# Altium schematic sheet HMI Features.SchDoc
size A3; Company Name: Renesas Electronics America; CompanyURL: www.renesas.com; PageSetup: Record=PageOptions|CenterHorizontal=True|CenterVertical=True|PrintScale=1.00|XCorrection=1.00|YCorrection=1.00|PrintKind=1|BorderSize=5000000|LeftOffset=0|BottomOffset=0|Orientation=2|PaperLength=1000|PaperWidth=1000|Scale=100|PaperSource=7|PrintQuality=-4|MediaType=1|DitherType=10|PaperKind=A5 148x210mm|PrintScaleMode=1; ReleaseDate: 16.09.2025; Version: MP; SheetNumber: 3; SheetTotal: 18; VariantNumber: 0; DSheetNumber: 1
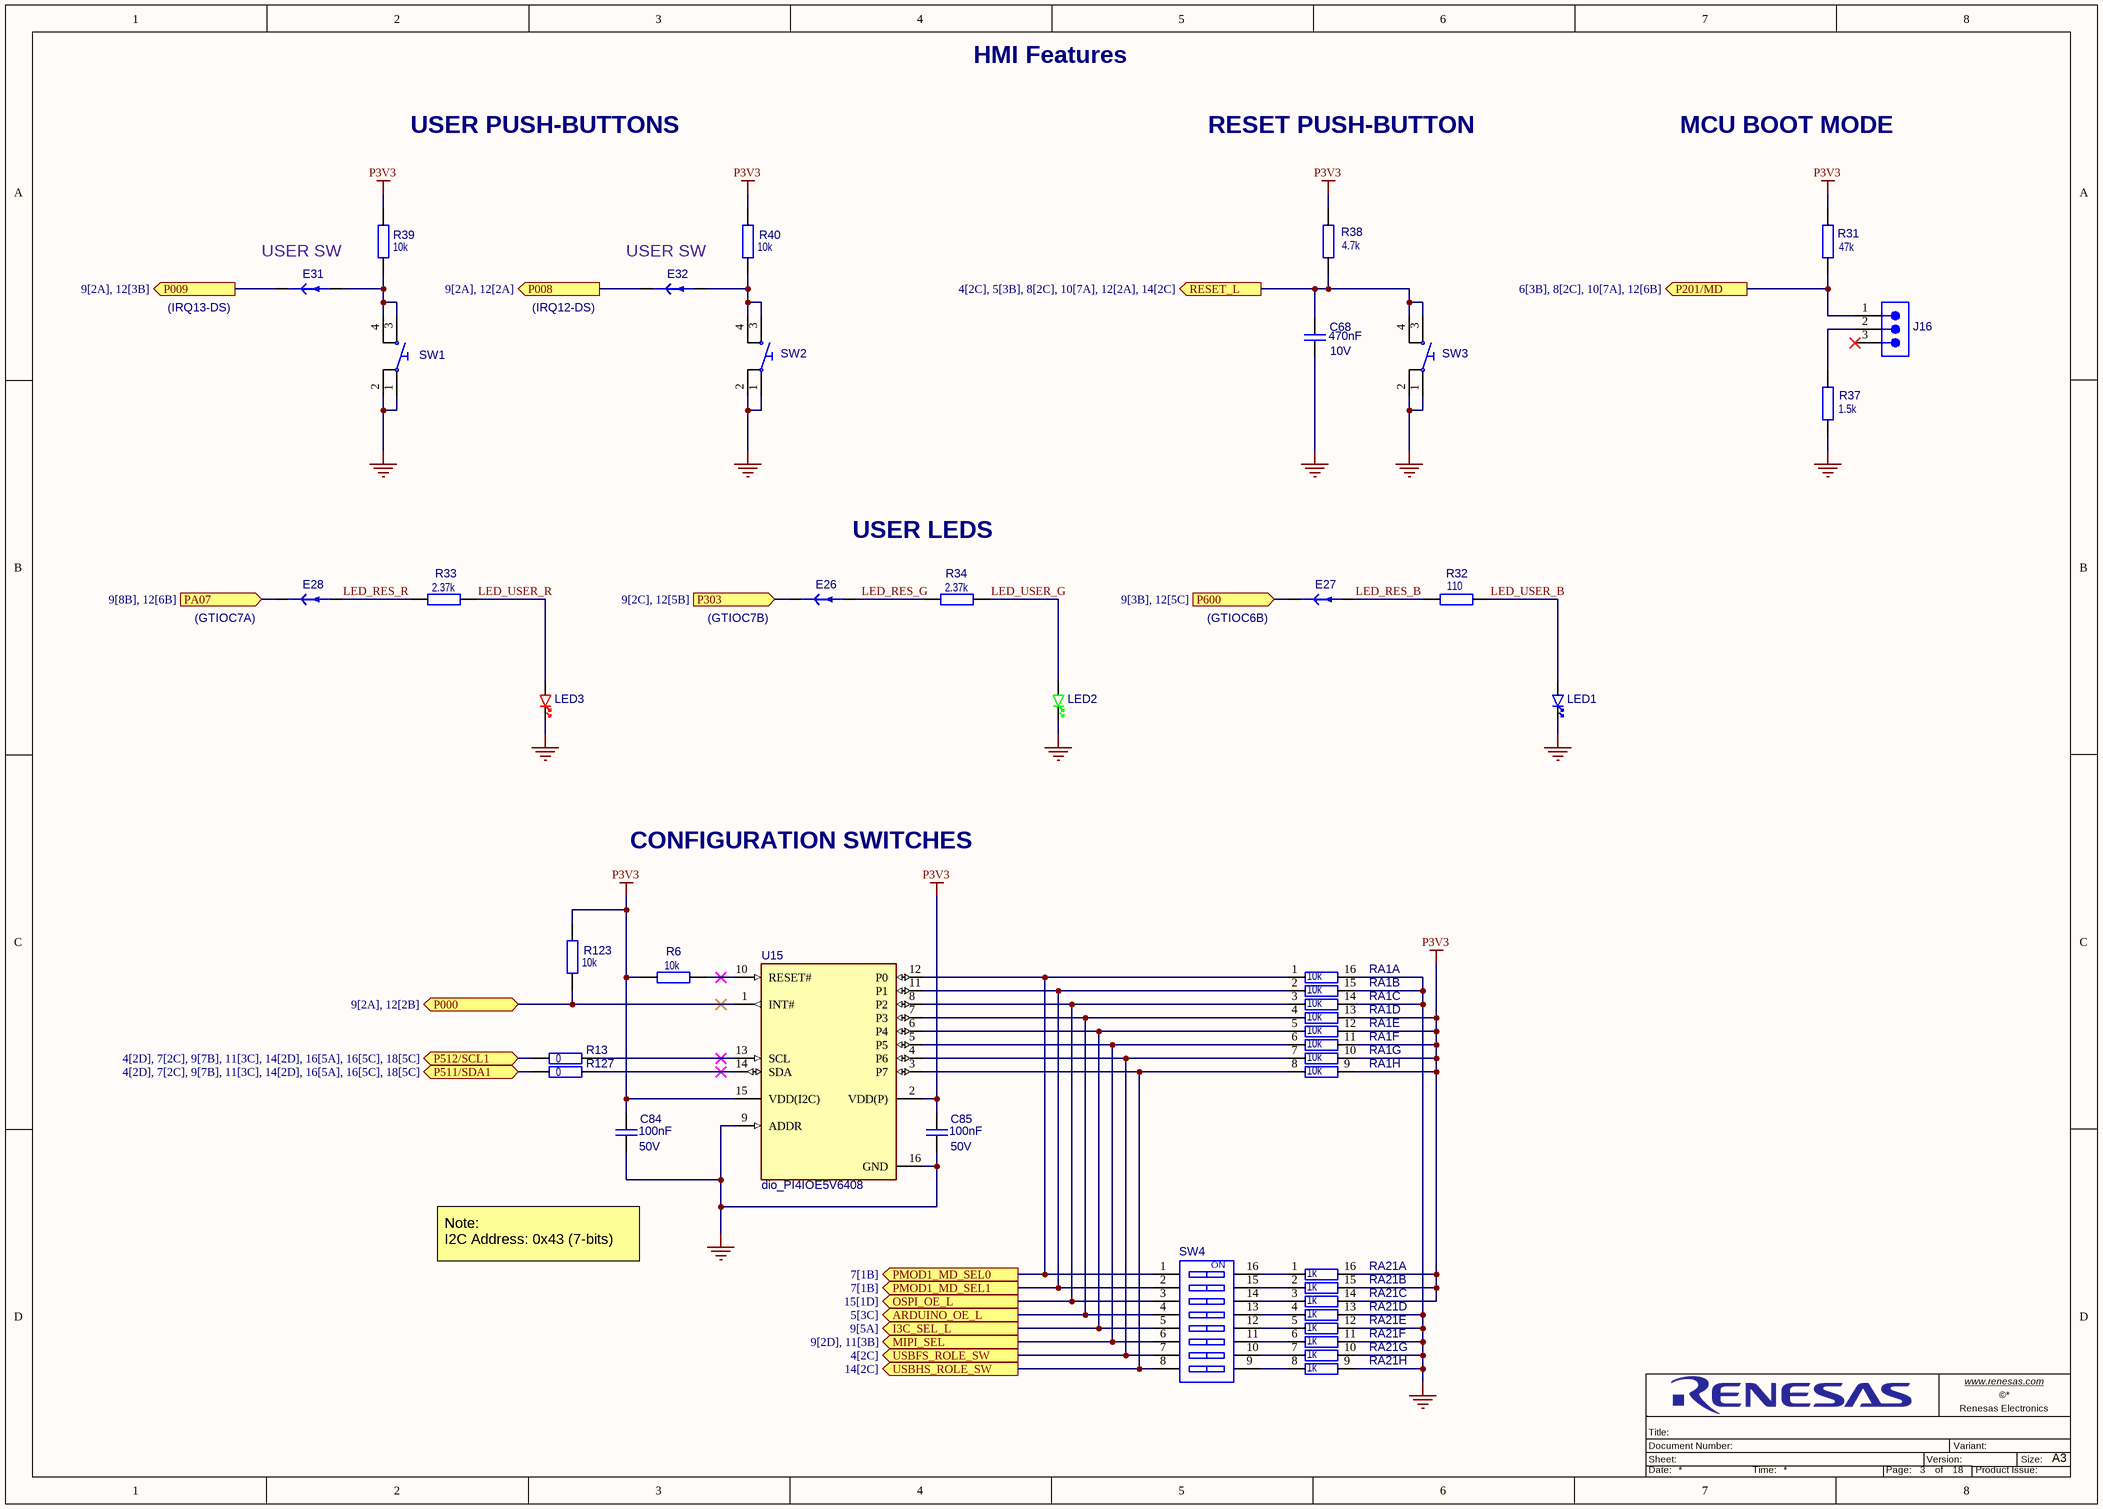
[diagram p0: HMI Features.SchDoc]

## Parts
C68  value 470nF  Operating Voltage Max: 10V  [C_EIA0402_0p55]  (hidden comment: Capacitor)
C84  value 100nF  Operating Voltage Max: 50V  [C_EIA0402_0p55]  (hidden comment: Capacitor)
C85  value 100nF  Operating Voltage Max: 50V  [C_EIA0402_0p55]  (hidden comment: Capacitor)
E26  TRACE_CUT_0805  [trace_cut_0805]  (value not drawn)  (net tie, no BOM)
E27  TRACE_CUT_0805  [trace_cut_0805]  (value not drawn)  (net tie, no BOM)
E28  TRACE_CUT_0805  [trace_cut_0805]  (value not drawn)  (net tie, no BOM)
E31  TRACE_CUT_0805  [trace_cut_0805]  (value not drawn)  (net tie, no BOM)
E32  TRACE_CUT_0805  [trace_cut_0805]  (value not drawn)  (net tie, no BOM)
J16  2842102-3  [tec_2842102-3]  (value not drawn)
LED1  150060BS75000  [led_0603_b]  (value not drawn)
LED2  150060GS75000  [led_0603_g]  (value not drawn)
LED3  150060RS75000  [led_0603_r]  (value not drawn)
R6  value 10k  [R_EIA0402]  (hidden comment: Resistor)
R13  value 0  [R_EIA0402]  (hidden comment: Resistor)
R31  value 47k  [R_EIA0402]  (hidden comment: Resistor)
R32  value 110  [R_EIA0402]  (hidden comment: Resistor)
R33  value 2.37k  [R_EIA0402]  (hidden comment: Resistor)
R34  value 2.37k  [R_EIA0402]  (hidden comment: Resistor)
R37  value 1.5k  [R_EIA0402]  (hidden comment: RC0402FR-071K5L)
R38  value 4.7k  [R_EIA0402]  (hidden comment: Resistor)
R39  value 10k  [R_EIA0402]  (hidden comment: Resistor)
R40  value 10k  [R_EIA0402]  (hidden comment: Resistor)
R123  value 10k  [R_EIA0402]  (hidden comment: Resistor)
R127  value 0  [R_EIA0402]  (hidden comment: Resistor)
RA1  value 10k  [R_Array_EIA1506]  (hidden comment: EXB-2HV103JV)  (parts A,B,C,D,E,F,G,H of 8)
RA21  value 1k  [R_Array_EIA1506]  (hidden comment: EXB-2HV102JV)  (parts A,B,C,D,E,F,G,H of 8)
SW1  PTS645SM43SMTR92LFS  [ck_PTS645_g_smt_4p3]  (value not drawn)
SW2  PTS645SM43SMTR92LFS  [ck_PTS645_g_smt_4p3]  (value not drawn)
SW3  PTS645SK43SMTR92LFS  [ck_PTS645_g_smt_4p3_red]  (value not drawn)
SW4  416131160808  [wue_416131160808]  (value not drawn)
U15  dio_PI4IOE5V6408  [dio_uqfn-16_zta16]

## Ports
ARDUINO_OE_L (out, see 5[3C]), I3C_SEL_L (out, see 9[5A]), MIPI_SEL (out, see 9[2D], 11[3B]), OSPI_OE_L (out, see 15[1D]), P000 (bidir, see 9[2A], 12[2B]), P008 (out, see 9[2A], 12[2A]), P009 (out, see 9[2A], 12[3B]), P201/MD (out, see 6[3B], 8[2C], 10[7A], 12[6B]), P303 (in, see 9[2C], 12[5B]), P511/SDA1 (bidir, see 4[2D], 7[2C], 9[7B], 11[3C], 14[2D], 16[5A], 16[5C], 18[5C]), P512/SCL1 (bidir, see 4[2D], 7[2C], 9[7B], 11[3C], 14[2D], 16[5A], 16[5C], 18[5C]), P600 (in, see 9[3B], 12[5C]), PA07 (in, see 9[8B], 12[6B]), PMOD1_MD_SEL0 (out, see 7[1B]), PMOD1_MD_SEL1 (out, see 7[1B]), RESET_L (out, see 4[2C], 5[3B], 8[2C], 10[7A], 12[2A], 14[2C]), USBFS_ROLE_SW (out, see 4[2C]), USBHS_ROLE_SW (out, see 14[2C])

## Nets
GND: C68.1 C84.1 C85.1 LED1.1(K) LED2.1(K) LED3.1(K) R37.1 RA1.14 RA1.15 RA1.16 RA21.9 RA21.10 RA21.11 RA21.12 RA21.13 SW1.1 SW1.2 SW2.1 SW2.2 SW3.1 SW3.2 U15.9(ADDR) U15.16(GND)
P3V3: C84.2 C85.2 R6.2 R31.2 R38.2 R39.2 R40.2 R123.2 RA1.9 RA1.10 RA1.11 RA1.12 RA1.13 RA21.14 RA21.15 RA21.16 U15.2(VDD(P)) U15.15(VDD(I2C))
ARDUINO_OE_L: RA1.4 SW4.4 U15.7(P3) ; port ARDUINO_OE_L
I3C_SEL_L: RA1.5 SW4.5 U15.6(P4) ; port I3C_SEL_L
LED_RES_B: E27.2 R32.1
LED_RES_G: E26.2 R34.1
LED_RES_R: E28.2 R33.1
LED_USER_B: LED1.2(A) R32.2
LED_USER_G: LED2.2(A) R34.2
LED_USER_R: LED3.2(A) R33.2
MIPI_SEL: RA1.6 SW4.6 U15.5(P5) ; port MIPI_SEL
OSPI_OE_L: RA1.3 SW4.3 U15.8(P2) ; port OSPI_OE_L
P000: R123.1 U15.1(INT#) ; port P000
P008: E32.1 ; port P008
P009: E31.1 ; port P009
P201/MD: J16.1 R31.1 ; port P201/MD
P303: E26.1 ; port P303
P511/SDA1: R127.2 ; port P511/SDA1
P512/SCL1: R13.2 ; port P512/SCL1
P600: E27.1 ; port P600
PA07: E28.1 ; port PA07
PMOD1_MD_SEL0: RA1.1 SW4.1 U15.12(P0) ; port PMOD1_MD_SEL0
PMOD1_MD_SEL1: RA1.2 SW4.2 U15.11(P1) ; port PMOD1_MD_SEL1
RESET_L: C68.2 R38.1 SW3.3 SW3.4 ; port RESET_L
USBFS_ROLE_SW: RA1.7 SW4.7 U15.4(P6) ; port USBFS_ROLE_SW
USBHS_ROLE_SW: RA1.8 SW4.8 U15.3(P7) ; port USBHS_ROLE_SW
NetE31_2: E31.2 R39.1 SW1.3 SW1.4
NetE32_2: E32.2 R40.1 SW2.3 SW2.4
NetJ16_2: J16.2 R37.2
NetR6_1: R6.1 U15.10(RESET#)
NetR13_1: R13.1 U15.13(SCL)
NetR127_1: R127.1 U15.14(SDA)
NetRA21_1: RA21.1 SW4.16
NetRA21_2: RA21.2 SW4.15
NetRA21_3: RA21.3 SW4.14
NetRA21_4: RA21.4 SW4.13
NetRA21_5: RA21.5 SW4.12
NetRA21_6: RA21.6 SW4.11
NetRA21_7: RA21.7 SW4.10
NetRA21_8: RA21.8 SW4.9

Not connected (* = marked no-connect by the designer): J16 3*

## Notes on the sheet
- HMI Features
- USER PUSH-BUTTONS
- RESET PUSH-BUTTON
- MCU BOOT MODE
- (IRQ13-DS)
- (near E31) USER SW
- (IRQ12-DS)
- (near E32) USER SW
- USER LEDS
- (near E28) (GTIOC7A)
- (near E26) (GTIOC7B)
- (near E27) (GTIOC6B)
- CONFIGURATION SWITCHES
- Note:
  I2C Address: 0x43 (7-bits)
- www.renesas.com <http://www.renesas.com>
- Sheet:
- Title:
- Document Number:
- Version:
- Variant:
- Renesas Electronics
- Size:
- A3
- Date:
- Time:
- Page:
- of
- Product Issue:
- (in symbol MEC-00003402-14) ON

## Library data of the parts
C68 = CAP-00003217-9: Capacitor,EIA0402,470n,10V,X7R; Tolerance: 10%; Qualification: AEC-Q200; Subtype: MLCC; Dielectric: X7R; Height: 550µm; Operating Temperature Max: 125°C; Operating Temperature Min: -55°C
C84 C85 = CAP-00003203-9: Capacitor,EIA0402,100n,50V,X7R; Tolerance: 10%; Qualification: AEC-Q200; Subtype: MLCC; Dielectric: X7R; Height: 550µm; Operating Temperature Max: 125°C; Operating Temperature Min: -55°C
E26-E28 E31 E32 = MIS-00000000-11: Trace Cut, SMD, 0805 size; Value: TC; Pin Count: 2; Qualification: -; Subtype: Trace Cut
J16 = CON-00000097-5: Header, 3way, 1row, vertical, 2.00mm, SMD; Gender: male; Current: 2A; Operating Voltage Max: 125V; Operating Temperature Max: 125°C; Pin Count: 3; Height: 6.55mm; Qualification: -; Operating Temperature Min: -40°C
LED1 = DIO-00000012-5: Standard LEDs - SMD Blue, 470nm 90 to 145 mcd; Reverse Voltage: 5V; Current: 30mA; Subtype: LED; Forward Voltage: 3.2V; Qualification: -; Height: 800µm; Operating Temperature Max: 85°C; Operating Temperature Min: -40°C
LED2 = DIO-00000013-5: Standard LEDs - SMD Green, 525nm 220 to 430 mcd; Subtype: LED; Forward Voltage: 3.2V; Current: 30mA; Reverse Voltage: 5V; Operating Temperature Min: -40°C; Operating Temperature Max: 85°C; Height: 800µm; Qualification: -
LED3 = DIO-00000014-5: Standard LEDs - SMD Red, 625nm 120 to 250 mcd; Reverse Voltage: 5V; Current: 30mA; Subtype: LED; Forward Voltage: 2V; Operating Temperature Min: -40°C; Qualification: -; Height: 800µm; Operating Temperature Max: 85°C
R6 R39 R40 R123 = RES-00000902-9: Resistor,EIA0402,10k,0.0625W; Power: 62.5mW; Tolerance: 1%; Subtype: Chip Resistor; Operating Temperature Max: 155°C; Operating Temperature Min: -55°C; Qualification: -
R13 R127 = RES-00000801-9: Resistor,EIA0402,0,0.0625W; Power: 62.5mW; Tolerance: 5%; Subtype: Chip Resistor; Operating Temperature Max: 155°C; Operating Temperature Min: -55°C; Qualification: -
R31 = RES-00000918-9: Resistor,EIA0402,47k,0.0625W; Power: 62.5mW; Tolerance: 1%; Subtype: Chip Resistor; Operating Temperature Max: 155°C; Operating Temperature Min: -55°C; Qualification: -
R32 = RES-00000855-9: Resistor,EIA0402,110,0.0625W; Power: 62.5mW; Tolerance: 1%; Subtype: Chip Resistor; Operating Temperature Max: 155°C; Operating Temperature Min: -55°C; Qualification: -
R33 R34 = RES-00001614-10: Resistor,EIA0402,2.37k,0.0625W; Power: 62.5mW; Tolerance: 1%; Subtype: Chip Resistor; Operating Temperature Max: 155°C; Operating Temperature Min: -55°C; Qualification: -
R37 = RES-00000882-9: Resistor,EIA0402,1.5k,0.0625W; Power: 62.5mW; Tolerance: 1%; Subtype: Chip Resistor; Operating Temperature Max: 155°C; Operating Temperature Min: -55°C; Qualification: -
R38 = RES-00000894-9: Resistor,EIA0402,4.7k,0.0625W; Power: 62.5mW; Tolerance: 1%; Subtype: Chip Resistor; Operating Temperature Max: 155°C; Operating Temperature Min: -55°C; Qualification: -
RA1 = RES-00003208-7: Resistor Network & Array,EIA1506,10k,0.063W; Subtype: Resistor Array; Qualification: AEC-Q200; Operating Voltage Max: 50V; Tolerance: 5%; Power: 62.5mW; Operating Temperature Min: -55°C; Height: 550µm; Operating Temperature Max: 125°C
RA21 = RES-00003215-4: Array/Network Resistor, Isolated, Metal Glaze/thick Film, 0.063W, 1000ohm, 25V, 5% +/-Tol, 200ppm/Cel, Surface Mount, 1506; Power: 63mW; Qualification: AEC-Q200; Temperature Coefficient: 200ppm; Subtype: Resistor Array; Height: 550µm; Operating Voltage Max: 25V; Tolerance: 5%; Operating Temperature Max: 125°C; Operating Temperature Min: -55°C
SW1 SW2 = MEC-00000002-3: SMD Push Button Switch, 4-pin, 6x6mm, 4.3mm height, Blue Actuator; Current: 50mA; Operating Voltage Max: 12V; Subtype: Switch; Operating Temperature Min: -20°C; Operating Temperature Max: 60°C
SW3 = MEC-00000000-9: SMD Push Button Switch, 4-pin, 6x6mm, 4.3mm height,  Red Actuator; Current: 50mA; Operating Voltage Max: 12V; Operating Temperature Max: 85°C; Operating Temperature Min: -40°C; Subtype: Switch
SW4 = MEC-00003402-14: WS-DISV Small Compact SMT Flat Actuator with Top Tape 1.27 mm; Current: 100mA; Operating Voltage Max: 50V; Subtype: Switch; Operating Temperature Max: 85°C; Operating Temperature Min: -40°C
U15 = ICS-00000012-5: Low-voltage translating 8-bit I2C-bus I/O Expander; Current: 300µA; Operating Voltage Max: 4V; Operating Voltage Min: 1.65V; Output Voltage Min: 0V; Subtype: Digital; Operating Temperature Max: -40°C; Operating Temperature Min: 85°C; Output Voltage Max: 4V; Pin Count: 16; Qualification: -